# EAGLE schematic stepperDriver (EAGLE 7.6.0)
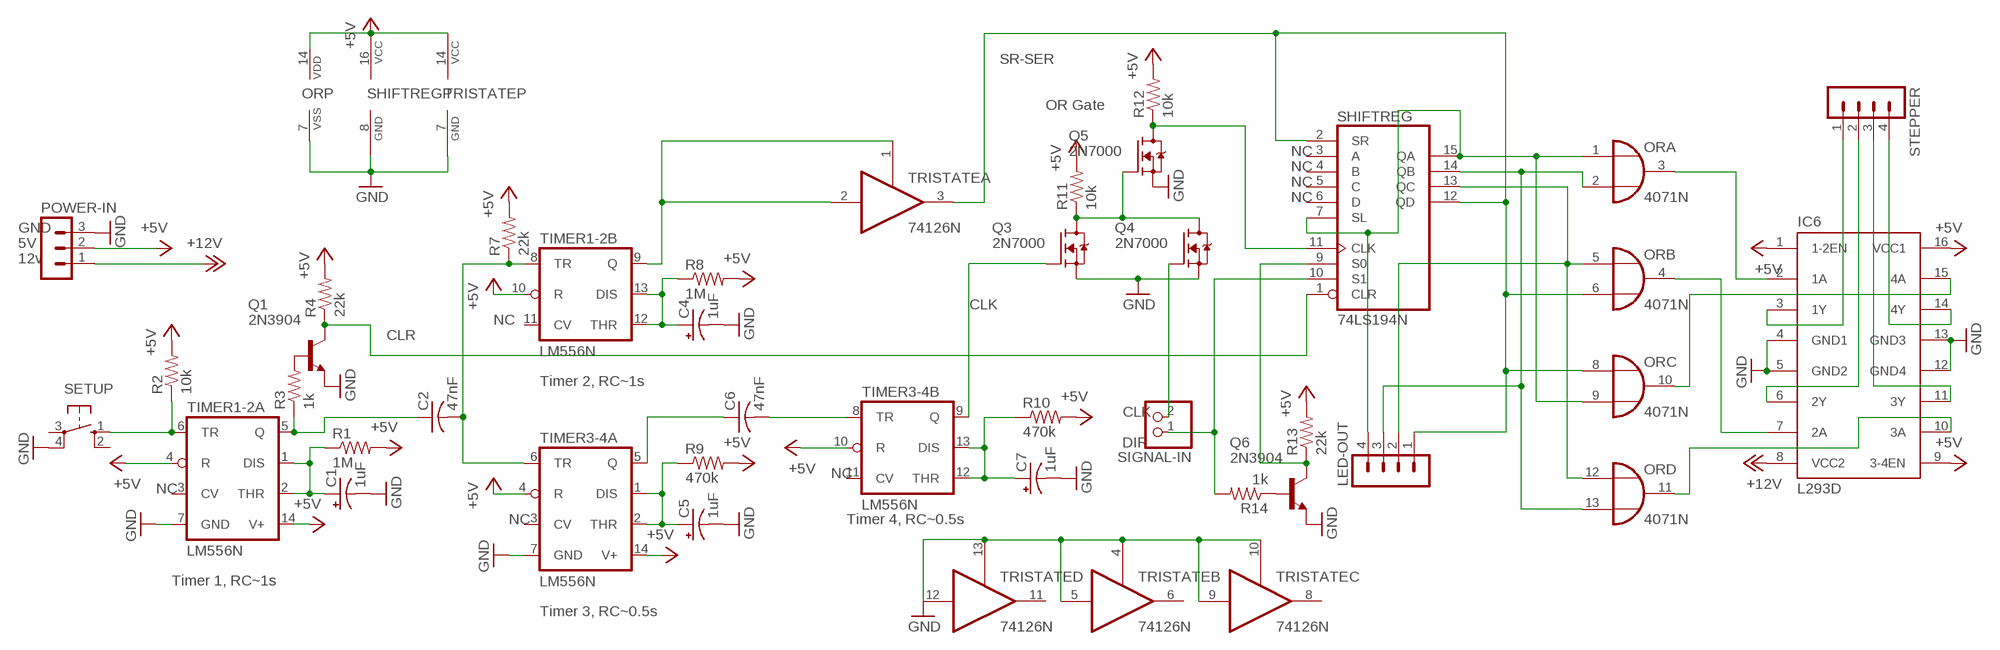
[diagram p0: schematic, sheet 1]

## Parts
C1  1uF  CPOL-USE2.5-6  [E2,5-6]
C2  47nF  C-US025-025X050  [C025-025X050]
C4  1uF  CPOL-USE2.5-6  [E2,5-6]
C5  1uF  CPOL-USE2.5-6  [E2,5-6]
C6  47nF  C-US025-025X050  [C025-025X050]
C7  1uF  CPOL-USE2.5-6  [E2,5-6]
IC6  L293D  [DIL16]
LED-OUT  MA04-1  [MA04-1]
OR  4071N  [DIL14]
POWER-IN  MA03-1  [MA03-1]
Q1  2N3904  [TO92]
Q3  2N7000  [TO92-]
Q4  2N7000  [TO92-]
Q5  2N7000  [TO92-]
Q6  2N3904  [TO92]
R1  1M  R-US_0204/7  [0204/7]
R2  10k  R-US_0204/7  [0204/7]
R3  1k  R-US_0204/7  [0204/7]
R4  22k  R-US_0204/7  [0204/7]
R7  22k  R-US_0204/7  [0204/7]
R8  1M  R-US_0204/7  [0204/7]
R9  470k  R-US_0204/7  [0204/7]
R10  470k  R-US_0204/7  [0204/7]
R11  10k  R-US_0204/7  [0204/7]
R12  10k  R-US_0204/7  [0204/7]
R13  22k  R-US_0204/7  [0204/7]
R14  1k  R-US_0204/7  [0204/7]
SETUP  10-XX  [B3F-10XX]
SHIFTREG  74LS194N  [DIL16]
SIGNAL-IN  PINHD-1X2  [1X02]
STEPPER  MA04-1  [MA04-1]
TIMER1-2  LM556N  [DIL14]
TIMER3-4  LM556N  [DIL14]
TRISTATE  74126N  [DIL14]

## Nets
+5V: IC6.1(1-2EN) IC6.9(3-4EN) IC6.16(VCC1) OR.14(P:VDD) POWER-IN.2 R1.2 R2.2 R4.2 R7.2 R8.2 R9.2 R10.2 R11.2 R12.2 R13.2 SHIFTREG.16(VCC) TIMER1-2.4(A:R) TIMER1-2.10(B:R) TIMER1-2.14(A:V+) TIMER3-4.4(A:R) TIMER3-4.10(B:R) TIMER3-4.14(A:V+) TRISTATE.14(P:VCC)
+12V: IC6.8(VCC2) POWER-IN.1
CLR: Q1.1(C) R4.1 SHIFTREG.1(CLR)
GND: C1.- C4.- C5.- C7.- IC6.4(GND1) IC6.5(GND2) IC6.12(GND4) IC6.13(GND3) OR.7(P:VSS) POWER-IN.3 Q1.3(E) Q3.3(S) Q4.3(S) Q5.3(S) Q6.3(E) SETUP.4(P1) SHIFTREG.8(GND) TIMER1-2.7(A:GND) TIMER3-4.7(A:GND) TRISTATE.4(B:OE) TRISTATE.5(B:I) TRISTATE.7(P:GND) TRISTATE.9(C:I) TRISTATE.10(C:OE) TRISTATE.12(D:I) TRISTATE.13(D:OE)
N$1: R2.1 SETUP.1(S) TIMER1-2.6(A:TR)
N$2: C1.+ R1.1 TIMER1-2.1(A:DIS) TIMER1-2.2(A:THR)
N$3: Q1.2(B) R3.2
N$4: C2.1 R3.1 TIMER1-2.5(A:Q)
N$5: C2.2 R7.1 TIMER1-2.8(B:TR) TIMER3-4.6(A:TR)
N$7: TIMER1-2.9(B:Q) TRISTATE.1(A:OE) TRISTATE.2(A:I)
N$8: C4.+ R8.1 TIMER1-2.12(B:THR) TIMER1-2.13(B:DIS)
N$10: C5.+ R9.1 TIMER3-4.1(A:DIS) TIMER3-4.2(A:THR)
N$11: C6.2 TIMER3-4.8(B:TR)
N$12: C6.1 TIMER3-4.5(A:Q)
N$13: Q4.2(G) SIGNAL-IN.2
N$14: Q6.1(C) R13.1 SHIFTREG.9(S0)
N$15: IC6.7(2A) OR.4(B:O)
N$16: C7.+ R10.1 TIMER3-4.12(B:THR) TIMER3-4.13(B:DIS)
N$17: Q3.1(D) Q4.1(D) Q5.2(G) R11.1
N$18: Q3.2(G) TIMER3-4.9(B:Q)
N$19: Q5.1(D) R12.1 SHIFTREG.11(CLK)
N$20: R14.2 SHIFTREG.10(S1) SIGNAL-IN.1
N$21: Q6.2(B) R14.1
N$22: LED-OUT.4 OR.1(A:I0) OR.9(C:I1) SHIFTREG.7(SL) SHIFTREG.15(QA)
N$23: LED-OUT.3 OR.2(A:I1) OR.13(D:I1) SHIFTREG.14(QB)
N$24: LED-OUT.2 OR.5(B:I0) OR.12(D:I0) SHIFTREG.13(QC)
N$25: LED-OUT.1 OR.6(B:I1) OR.8(C:I0) SHIFTREG.2(SR) SHIFTREG.12(QD) TRISTATE.3(A:O)
N$26: IC6.2(1A) OR.3(A:O)
N$27: IC6.15(4A) OR.10(C:O)
N$28: IC6.10(3A) OR.11(D:O)
N$29: IC6.3(1Y) STEPPER.1
N$30: IC6.6(2Y) STEPPER.2
N$31: IC6.11(3Y) STEPPER.3
N$32: IC6.14(4Y) STEPPER.4
Unconnected: SETUP.2(S1) SETUP.3(P) SHIFTREG.3(A) SHIFTREG.4(B) SHIFTREG.5(C) SHIFTREG.6(D) TIMER1-2.3(A:CV) TIMER1-2.11(B:CV) TIMER3-4.3(A:CV) TIMER3-4.11(B:CV) TRISTATE.6(B:O) TRISTATE.8(C:O) TRISTATE.11(D:O)

## Notes on the sheet
- SR-SER
- OR Gate
- NC
- NC
- NC
- NC
- GND
- 5V
- 12v
- CLK
- NC
- CLR
- Timer 2, RC~1s
- CLK
- DIR
- NC
- NC
- NC | Timer 4, RC~0.5s
- Timer 1, RC~1s
- Timer 3, RC~0.5s

## Library data of the parts
C1 C4 C5 C7 = rcl:CPOL-US: POLARIZED CAPACITOR, American symbol
C2 C6 = rcl:C-US: CAPACITOR, American symbol
IC6 = st-microelectronics:L293D: PUSH-PULL 4 CHANNEL DRIVER; MPN: L293D; OC_FARNELL: 9589619; OC_NEWARK: 56P8249
LED-OUT STEPPER = con-lstb:MA04-1: PIN HEADER; OC_FARNELL: unknown; OC_NEWARK: unknown
OR = 40xx:4071: Quad 2-input OR
POWER-IN = con-lstb:MA03-1: PIN HEADER; OC_FARNELL: unknown; OC_NEWARK: unknown
Q1 Q6 = transistor-npn:2N3904: NPN Transistor
Q3-Q5 = transistor-fet:2N7000: 2n7000 N-Channel Mosfet, 60V/200mA
R1-R4 R7-R14 = rcl:R-US_: RESISTOR, American symbol
SETUP = switch-omron:10-XX: OMRON SWITCH; MPN: B3F-1000; OC_FARNELL: 176432; OC_NEWARK: 36M3542
SHIFTREG = 74xx-us:74*194: 4-bit bidirectional SHIFT REGISTER
SIGNAL-IN = pinhead:PINHD-1X2: PIN HEADER
TIMER1-2 TIMER3-4 = linear:*556: Dual TIMER
TRISTATE = 74xx-us:74*126: Quad bus BUFFER, 3-state